# Altium schematic sheet Voltage Source.SchDoc
size A4; SheetNumber: 3; SheetTotal: 5
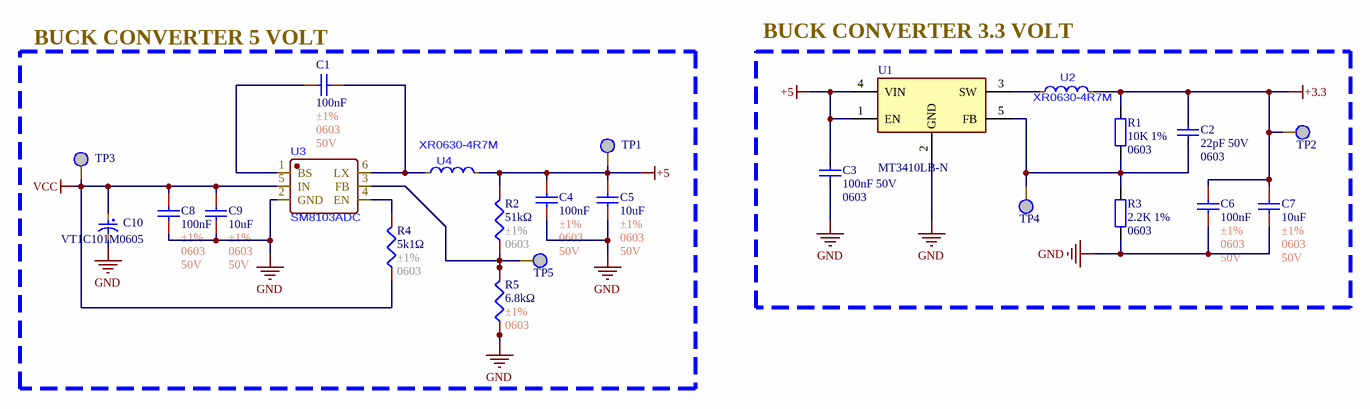
[diagram p0: Voltage Source.SchDoc]

## Parts
C1  100nF  Tolerance: ±1%  Package: 0603  Voltage Rating: 50V  [C0603]
C2  22pF 50V  Package: 0603  [C0603]
C3  100nF 50V  Package: 0603  [C0603]
C4  100nF  Tolerance: ±1%  Package: 0603  Voltage Rating: 50V  [C0603]
C5  10uF  Tolerance: ±1%  Package: 0603  Voltage Rating: 50V  [C0603]
C6  100nF  Tolerance: ±1%  Package: 0603  Voltage Rating: 50V  [C0603]
C7  10uF  Tolerance: ±1%  Package: 0603  Voltage Rating: 50V  [C0603]
C8  100nF  Tolerance: ±1%  Package: 0603  Voltage Rating: 50V  [C0603]
C9  10uF  Tolerance: ±1%  Package: 0603  Voltage Rating: 50V  [C0603]
C10  VT1C101M0605  [C_100uF_16V_Aluminum]
R1  10K 1%  Package: 0603  [RES_SMD_0603]
R2  51kΩ  Tolerance: ±1%  Package: 0603  [R0603]
R3  2.2K 1%  Package: 0603  [RES_SMD_0603]
R4  5k1Ω  Tolerance: ±1%  Package: 0603  [R0603]
R5  6.8kΩ  Tolerance: ±1%  Package: 0603  [R0603]
TP1  TP  [TP]  (value not drawn)
TP2  TP  [TP]  (value not drawn)
TP3  TP  [TP]  (value not drawn)
TP4  TP  [TP]  (value not drawn)
TP5  TP  [TP]  (value not drawn)
U1  MT3410LB-N  [SOT23_5]
U2  XR0630-4R7M  [SMD,7x6.6mm]
U3  SM8103ADC  [TSOT-23-6]
U4  XR0630-4R7M  [SMD,7x6.6mm]

## Blocks framed on the sheet
BUCK CONVERTER 5 VOLT: C1 C4 C5 C8-C10 R2 R4 R5 TP1 TP3 TP5 U3 U4
BUCK CONVERTER 3.3 VOLT: C2 C3 C6 C7 R1 R3 TP2 TP4 U1 U2

## Nets
+3.3: C2.2 C6.1 C7.1 R1.2 TP2.1 U2.2(F)
+5: C3.2 C4.1 C5.1 R2.2 TP1.1 U1.1(EN) U1.4(VIN) U4.2(F)
GND: C3.1 C4.2 C5.2 C6.2 C7.2 C8.2 C9.2 C10.2 R3.1 R5.1 U1.2(GND) U3.2(GND)
VCC: C8.1 C9.1 C10.1 R4.1 TP3.1 U3.5(IN)
NetC1_1: C1.1 U3.6(LX) U4.1(S)
NetC1_2: C1.2 U3.1(BS)
NetC2_1: C2.1 R1.1 R3.2 TP4.1 U1.5(FB)
NetR2_1: R2.1 R5.2 TP5.1 U3.3(FB)
NetR4_2: R4.2 U3.4(EN)
NetU1_3: U1.3(SW) U2.1(S)

## Notes on the sheet
- Author:
- Title:
- Size:
- A4
- Project:
- Approved:
- Revision:
- Modified Date:
- CONFIDENTIAL
- Date:
- SW Version:

## Library data of the parts
C1 C4 C6 C8 = C0603_100nF_±1%: Manufacturer: YAGEO; Mfr. Part #: CC0402FRNPO9BN100; LCSC Part #: C513681; Link: https://www.lcsc.com/product-detail/C513681.html?s_z=n_capital%2520yageo%252010pF%25200402; Capacitance: 100nF
C2 = C0603_MLCC_22pF_50V: 50V 22pF NP0 ±5% 0603 Multilayer Ceramic Capacitors MLCC - SMD/SMT ROHS; Manufacturer: YAGEO; Manufacture Part Number: CC0603JRNPO9BN220; Packaging: Cut Tape (CT); Link: https://www.lcsc.com/product-detail/Multilayer-Ceramic-Capacitors-MLCC-SMD-SMT_YAGEO-CC0603JRNPO9BN220_C105620.html?s_z=n_22pF%2050V%200603
C3 = C0603_MLCC_100nF_50V: 50V 100nF X7R ±10% 0603 Multilayer Ceramic Capacitors MLCC - SMD/SMT ROHS; Manufacturer: YAGEO; Manufacture Part Number: CC0603KRX7R9BB104; Packaging: Cut Tape (CT); Link: https://www.lcsc.com/product-detail/Multilayer-Ceramic-Capacitors-MLCC-SMD-SMT_YAGEO-CC0603KRX7R9BB104_C14663.html?s_z=n_100nF%2050V%200603
C5 C7 C9 = C0603_10uF_±1%: Manufacturer: YAGEO; Mfr. Part #: CC0402FRNPO9BN100; LCSC Part #: C513681; Link: https://www.lcsc.com/product-detail/C513681.html?s_z=n_capital%2520yageo%252010pF%25200402; Capacitance: 10uF
C10 = C_100uF_16V_aluminum: 100uF 16V ±20% 63mA@120Hz SMD,D6.3xL5.4mm Aluminum Electrolytic Capacitors RoHS; Manufacturer: ROQANG; Key Attributes: CAP ALUM 100uF ±20% 16V SMD; Mfr. Part #: VT1C101M0605; LCSC Part #: C90273; Package: SMD,D6.3xL5.4mm; Link: https://www.lcsc.com/product-detail/C90273.html?s_z=n_capital%2520100uf%2520aluminum
R1 = R0603_10K: 10 kOhms ±1% 0.1W, 1/10W Chip Resistor 0603 (1608 Metric) Moisture Resistant Thick Film; Manufacturer: YAGEO; Manufacture Part Number: RC0603FR-0710KL; Packaging: Cut Tape (CT); Link: https://www.digikey.com/en/products/detail/yageo/RC0603FR-0710KL/726880
R2 = R0603_51kΩ_±1%: 100mW Thick Film Resistor 75V ±100ppm/℃ ±1% 51kΩ 0603 Chip Resistor - Surface Mount ROHS; Manufacturer: FOJAN; Mfr. Part #: FRC0603F5101TS; Key Attributes: RES 5.1kΩ ±1% 100mW 0603; LCSC Part #: C2907044; Link: https://www.lcsc.com/product-detail/C2907044.html?s_z=n_5k1%25200603; Resistance: 51kΩ
R3 = R0603_2.2K: 2.2 kOhms ±1% 0.1W, 1/10W Chip Resistor 0603 (1608 Metric) Moisture Resistant Thick Film; Manufacturer: YAGEO; Manufacture Part Number: RC0603FR-072K2L; Packaging: Cut Tape (CT); Link: https://www.digikey.com/en/products/detail/yageo/RC0603FR-072K2L/727016
R4 = R0603_5k1Ω_±1%: 100mW Thick Film Resistor 75V ±100ppm/℃ ±1% 5.1kΩ 0603 Chip Resistor - Surface Mount ROHS; Manufacturer: FOJAN; Mfr. Part #: FRC0603F5101TS; Key Attributes: RES 5.1kΩ ±1% 100mW 0603; LCSC Part #: C2907044; Link: https://www.lcsc.com/product-detail/C2907044.html?s_z=n_5k1%25200603; Resistance: 5k1Ω
R5 = R0603_6.8kΩ_±1%_1: 6.8k; Manufacturer: YAGEO; Mfr. Part #: RC0402FR-0710RL; LCSC Part #: C138066; Resistance: 6.8kΩ; Link: https://www.lcsc.com/product-detail/C138066.html?s_z=n_resistor%25200402%252010R
U1 = MT3410LB-N: SOT-23-5 DC-DC Converters ROHS; Manufacturer: XI'AN Aerosemi Tech; Manufacture Part Number: MT3410LB-N; Packaging: Cut Tape; Link: https://www.lcsc.com/product-detail/DC-DC-Converters_XI-AN-Aerosemi-Tech-MT3410LB-N_C42420805.html?s_z=n_mt3410l; Package: SOT-23-5
U2 U4 = FIXED IND 4.7uH 6A 33mΩ SMD,0630: Manufacturer: XR; MPN: XR0630-4R7M; LCSC Part #: C5307631; Packaging: SMD,7x6.6mm; Link: https://www.lcsc.com/product-detail/C5307631.html?s_z=n_q_t_INDUCTOR%25200630&spm=wm.fly.bg.0.xh___wm.ssy.tc.0.tz&lcsc_vid=FFlaVlZURFlbX1EAE1lbUlZfQwdeBlBRQ1VZBFdQQwUxVlNeRlRfU1ZRQlNZXzsOAxUeFF5JWBYZEEoKFBINSQcJGk4eFQsCAgIaSgADAwAHC0slQ1ZXV1NWWQkaCgg%3D
U3 = SM8103ADC: High Efficiency, 3.0A, 18V Input Synchronous Step Down Regulator; Manufacturer: Silergy; MPN: SM8103ADC; LCSC Part #: C479070; Packaging: TSOT-23-6; Link: https://www.lcsc.com/product-detail/C479070.html?s_z=s_p_SM8103ADC&spm=wm.fly.bg.0.xh&lcsc_vid=FFlaVlZURFlbX1EAE1lbUlZfQwdeBlBRQ1VZBFdQQwUxVlNeRlReUVRTQVFeUDsOAxUeFF5JWBYZEEoKFBINSQcJGk4dAgUUFAk%3D